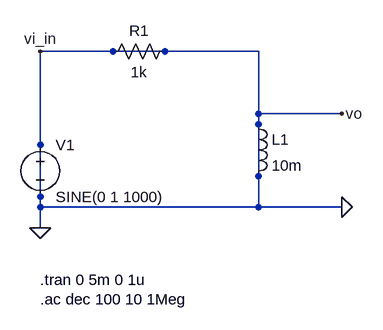
[diagram p0: schematic 07_circuit_generated-by-claude-sonnet-4-6.asc]
07_circuit_generated-by-claude-sonnet-4-6.asc, the LTspice schematic file:
Version 4
SHEET 1 880 680
WIRE 112 128 112 400
WIRE 112 128 256 128
WIRE 256 128 448 128
WIRE 448 128 448 224
WIRE 448 224 448 368
WIRE 448 368 112 368
WIRE 112 400 112 368
WIRE 448 224 576 224
WIRE 448 368 576 368
FLAG 112 400 0
FLAG 576 224 vo
FLAG 576 368 0
FLAG 112 128 vi_in
SYMBOL voltage 112 256 R0
SYMATTR InstName V1
SYMATTR Value SINE(0 1 1000)
SYMATTR SpiceLine AC 1
SYMBOL res 320 112 R90
WINDOW 0 0 56 VBottom 2
WINDOW 3 32 56 VTop 2
SYMATTR InstName R1
SYMATTR Value 1k
SYMBOL ind 432 224 R0
SYMATTR InstName L1
SYMATTR Value 10m
SYMATTR SpiceLine Rser=0
TEXT 112 480 Left 2 !.tran 0 5m 0 1u
TEXT 112 510 Left 2 !.ac dec 100 10 1Meg

The netlist it stands for:
* 07_circuit_generated-by-claude-sonnet-4-6.asc
V1 0 0 SINE(0 1 1000) AC 1
R1 0 0 1k
L1 0 0 10m Rser=0
.tran 0 5m 0 1u
.ac dec 100 10 1Meg
.backanno
.end